# EasyEDA schematic SCH_keyboard_2024-07-08.json
TITLE: Sheet_1; REV: 1.0; Date: 2024-07-07; Sheet: 1/1; Drawn By: dtnthuy; Company: Your Company
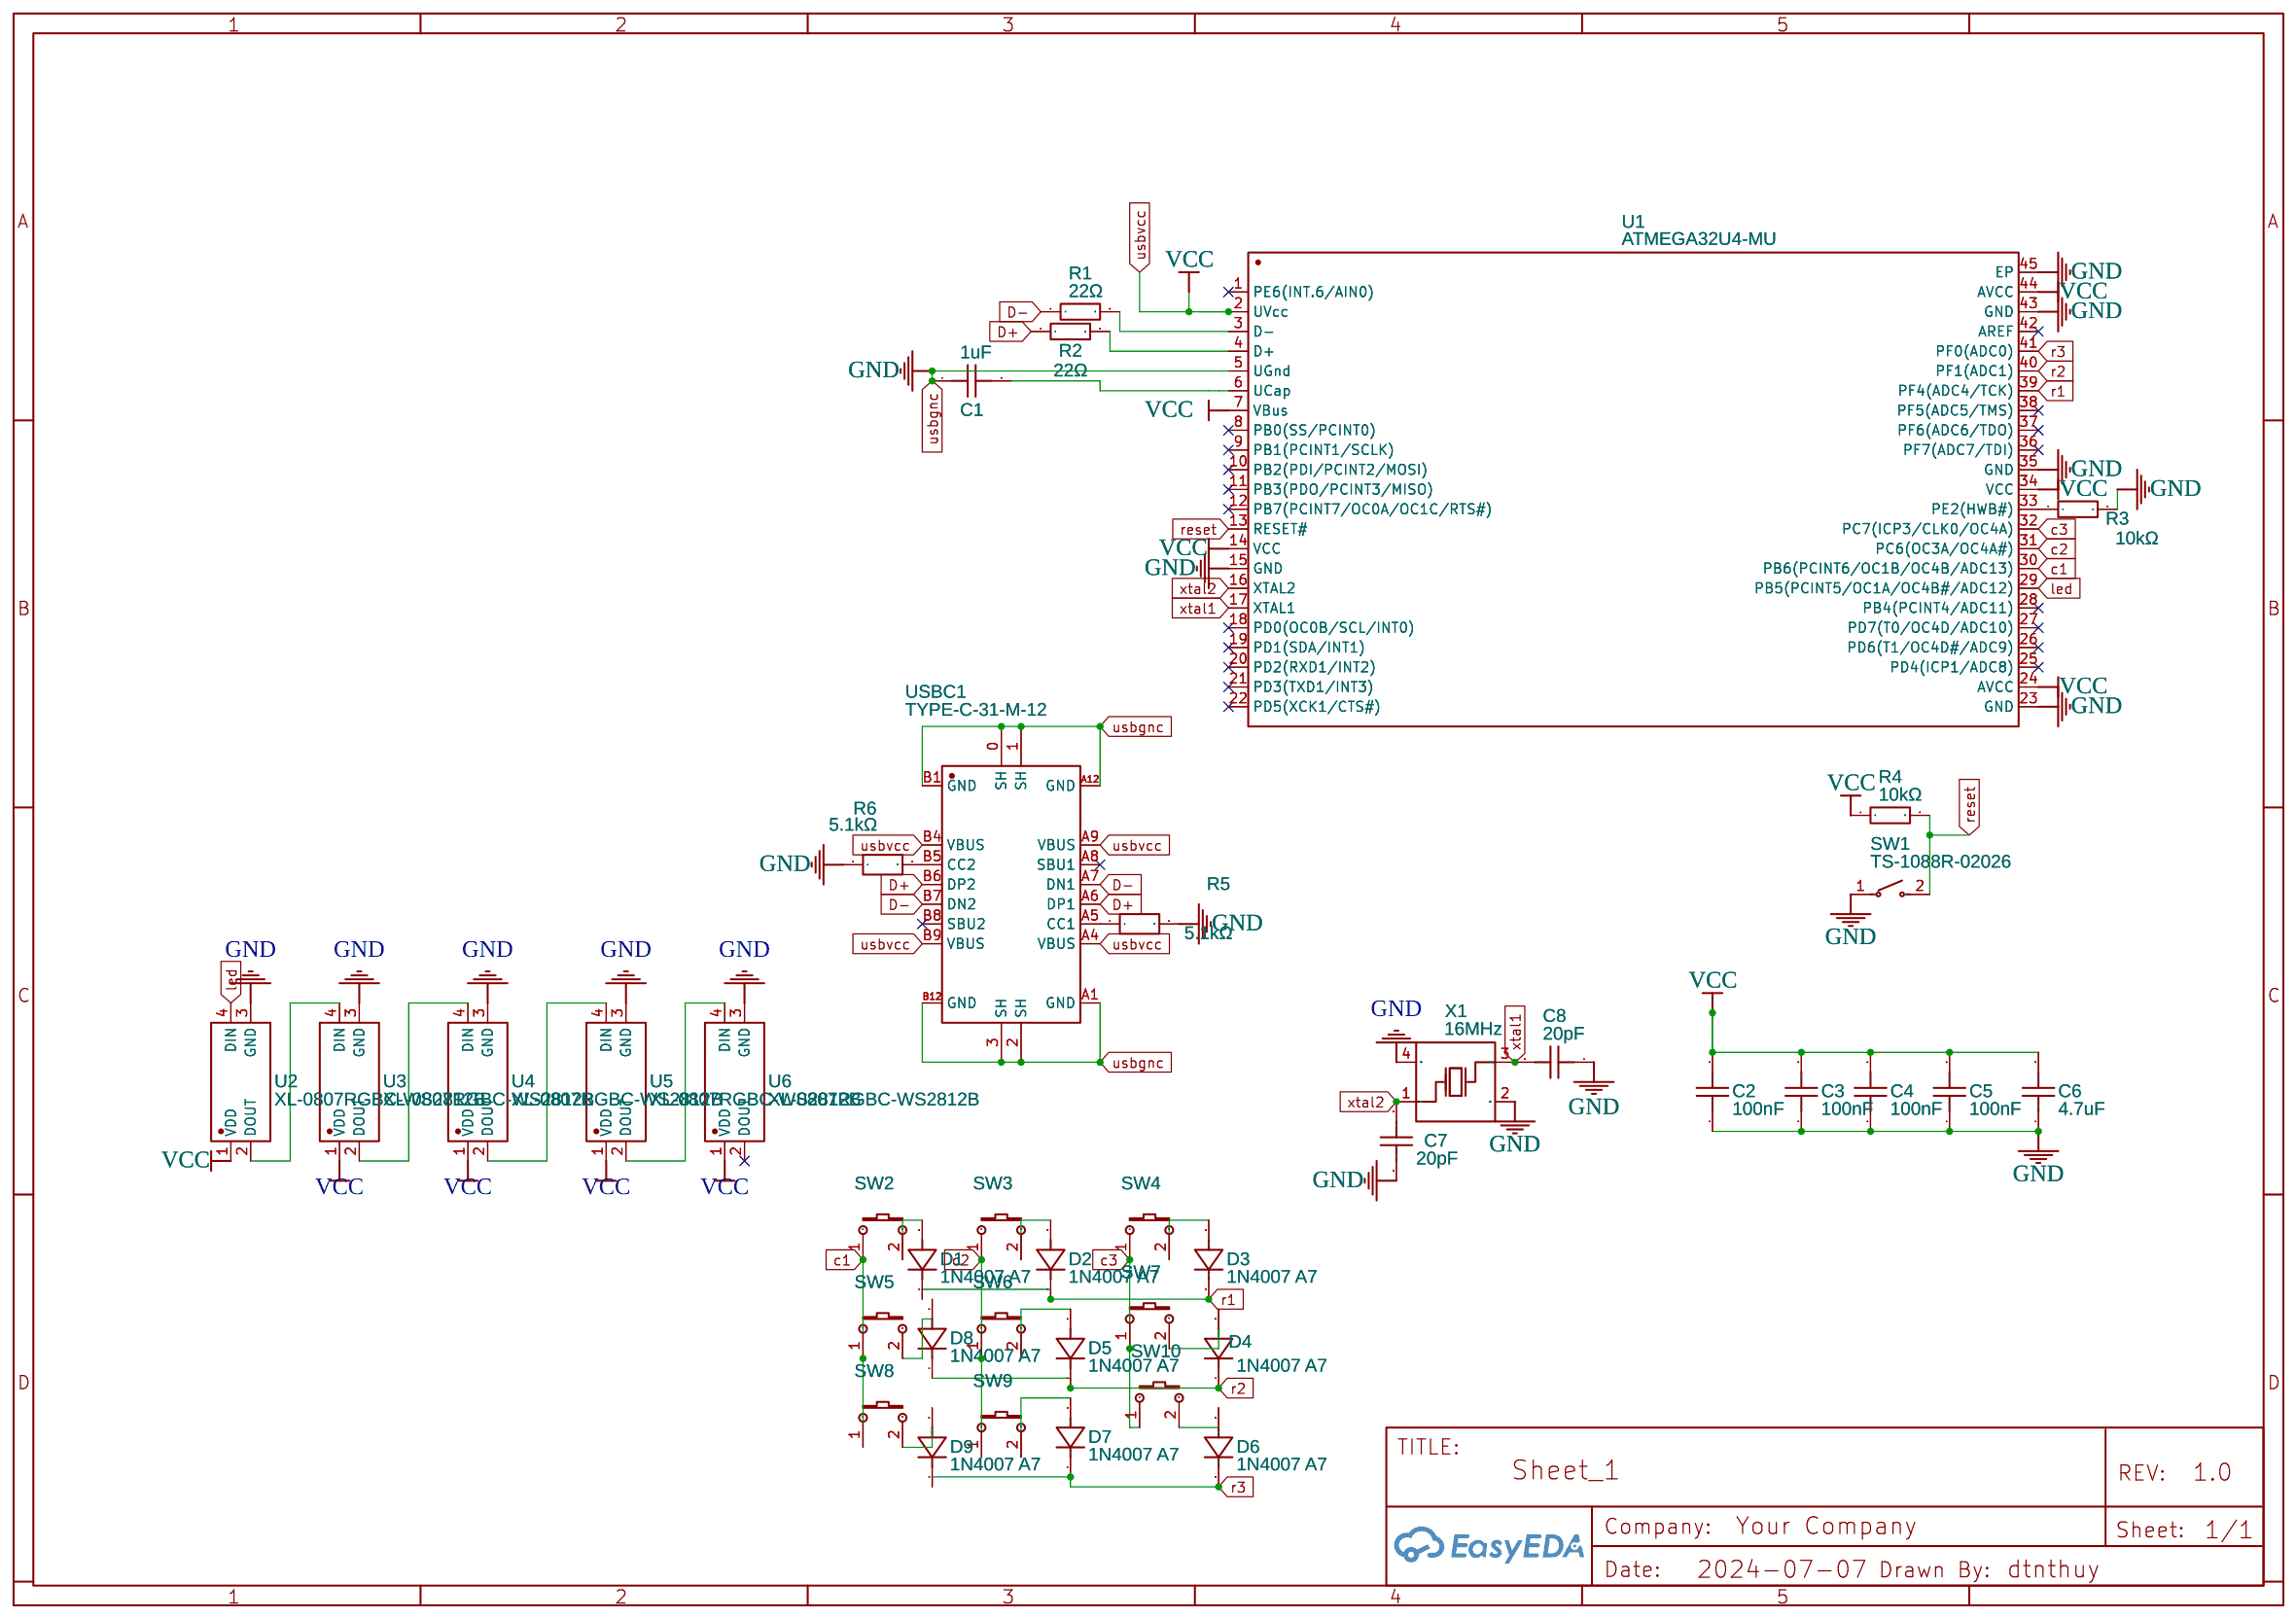
[diagram p0: schematic sheet]

## Parts
C1  1uF  [C0603]
C2  100nF  [C0402]
C3  100nF  [C0402]
C4  100nF  [C0402]
C5  100nF  [C0402]
C6  4.7uF  [C0402]
C7  20pF  [C0201]
C8  20pF  [C0201]
D1  1N4007 A7  [SOD-123FL_L2.8-W1.8-LS3.7-RD]
D2  1N4007 A7  [SOD-123FL_L2.8-W1.8-LS3.7-RD]
D3  1N4007 A7  [SOD-123FL_L2.8-W1.8-LS3.7-RD]
D4  1N4007 A7  [SOD-123FL_L2.8-W1.8-LS3.7-RD]
D5  1N4007 A7  [SOD-123FL_L2.8-W1.8-LS3.7-RD]
D6  1N4007 A7  [SOD-123FL_L2.8-W1.8-LS3.7-RD]
D7  1N4007 A7  [SOD-123FL_L2.8-W1.8-LS3.7-RD]
D8  1N4007 A7  [SOD-123FL_L2.8-W1.8-LS3.7-RD]
D9  1N4007 A7  [SOD-123FL_L2.8-W1.8-LS3.7-RD]
R1  22Ω  [R0603]
R2  22Ω  [R0603]
R3  10kΩ  [R0805]
R4  10kΩ  [R0805]
R5  5.1kΩ  [R0603]
R6  5.1kΩ  [R0603]
SW1  TS-1088R-02026  [SW-SMD_L3.9-W3.0-P4.45]
SW2  MX1A-11NW  [SW-TH_MX1A-11NW]
SW3  MX1A-11NW  [SW-TH_MX1A-11NW]
SW4  MX1A-11NW  [SW-TH_MX1A-11NW]
SW5  MX1A-11NW  [SW-TH_MX1A-11NW]
SW6  MX1A-11NW  [SW-TH_MX1A-11NW]
SW7  MX1A-11NW  [SW-TH_MX1A-11NW]
SW8  MX1A-11NW  [SW-TH_MX1A-11NW]
SW9  MX1A-11NW  [SW-TH_MX1A-11NW]
SW10  MX1A-11NW  [SW-TH_MX1A-11NW]
U1  ATMEGA32U4-MU  [VQFN-44_L7.0-W7.0-P0.50-BL-EP5.2]
U2  XL-0807RGBC-WS2812B  [LED-SMD_4P-L2.0-W1.8_CY-0807]
U3  XL-0807RGBC-WS2812B  [LED-SMD_4P-L2.0-W1.8_CY-0807]
U4  XL-0807RGBC-WS2812B  [LED-SMD_4P-L2.0-W1.8_CY-0807]
U5  XL-0807RGBC-WS2812B  [LED-SMD_4P-L2.0-W1.8_CY-0807]
U6  XL-0807RGBC-WS2812B  [LED-SMD_4P-L2.0-W1.8_CY-0807]
USBC1  TYPE-C-31-M-12  [USB-C_SMD-TYPE-C-31-M-12]
X1  16MHz  [CRYSTAL-SMD_4P-L3.2-W2.5-BL]

## Library data of the parts
C1 = CS1608X7R105K250NRB: Contributor: LCSC; Supplier: LCSC; Supplier Part: C513775; Manufacturer: SAMWHA(三和); JLCPCB Part Class: Extended Part
C2-C5 = C0402X7R104K250NT: Contributor: LCSC; Supplier: LCSC; Supplier Part: C466614; Manufacturer: SANYEAR(叁叶源); JLCPCB Part Class: Extended Part
C6 = C1005X6S0G475MTJ00E: Contributor: LCSC; Supplier: LCSC; Supplier Part: C342992; Manufacturer: TDK; JLCPCB Part Class: Extended Part
C7 C8 = 0201CG200K500NT: Contributor: LCSC; Supplier: LCSC; Supplier Part: C285071; Manufacturer: FH(风华)
D1-D9 = 1N4007 A7: Contributor: lcsc; Supplier: LCSC; Supplier Part: C2902912; Manufacturer: MSKSEMI(美森科); JLCPCB Part Class: Extended Part
R1 R2 = 0603WAJ0220T5E: Supplier: LCSC; Manufacturer: UNI-ROYAL(厚声); Supplier Part: C1203; JLCPCB Part Class: Extended Part
R3 R4 = 0805W8F1002T5E: Supplier: LCSC; Manufacturer: UNI-ROYAL(厚声); Supplier Part: C17414; JLCPCB Part Class: Basic Part
R5 R6 = RK73H1JTTD5101D: Contributor: LCSC; Supplier: LCSC; Supplier Part: C880144; Manufacturer: KOA; JLCPCB Part Class: Extended Part
SW1 = TS-1088R-02026: Contributor: LCSC; Supplier: LCSC; Supplier Part: C455280; Manufacturer: XUNPU(讯普); JLCPCB Part Class: Extended Part
SW2-SW10 = MX1A-11NW: Supplier: LCSC; Supplier Part: C3316924; Manufacturer: CHERRY; Contributor: lcsc
U1 = ATMEGA32U4-MU: Supplier: LCSC; Manufacturer: MICROCHIP(美国微芯); Supplier Part: C112161; JLCPCB Part Class: Extended Part
U2-U6 = XL-0807RGBC-WS2812B: Contributor: lcsc; Supplier: LCSC; Supplier Part: C3646929; Manufacturer: XINGLIGHT(成兴光); JLCPCB Part Class: Extended Part
USBC1 = TYPE-C-31-M-12: Contributor: LCSC; Supplier: LCSC; Supplier Part: C165948; Manufacturer: 韩国韩荣; JLCPCB Part Class: Extended Part
X1 = X322516MOB4SI: Supplier: LCSC; Manufacturer: YXC(扬兴晶振); Supplier Part: C12668; JLCPCB Part Class: Extended Part

## Nets
GND: C1.1 C2.1 C3.1 C4.1 C5.1 C6.1 C7.1 C8.1 R3.2 R5.2 R6.1 SW1.1 U1.5(UGnd) U1.15(GND) U1.23(GND) U1.35(GND) U1.43(GND) U1.45(EP) U2.3(GND) U3.3(GND) U4.3(GND) U5.3(GND) U6.3(GND) USBC1.0(SH) USBC1.1(SH) USBC1.2(SH) USBC1.3(SH) USBC1.A1(GND) USBC1.A12(GND) USBC1.B1(GND) USBC1.B12(GND) X1.2(GND) X1.4(GND)
VCC: C2.2 C3.2 C4.2 C5.2 C6.2 R4.1 U1.2(UVcc) U1.7(VBus) U1.14(VCC) U1.24(AVCC) U1.34(VCC) U1.44(AVCC) U2.1(VDD) U3.1(VDD) U4.1(VDD) U5.1(VDD) U6.1(VDD) USBC1.A4(VBUS) USBC1.A9(VBUS) USBC1.B4(VBUS) USBC1.B9(VBUS)
c1: SW2.1 SW5.1 SW8.1 U1.30(PB6(PCINT6/OC1B/OC4B/ADC13))
c2: SW3.1 SW6.1 SW9.1 U1.31(PC6(OC3A/OC4A#))
c3: SW4.1 SW7.1 SW10.1 U1.32(PC7(ICP3/CLK0/OC4A))
D+: R2.1 USBC1.A6(DP1) USBC1.B6(DP2)
D-: R1.1 USBC1.A7(DN1) USBC1.B7(DN2)
led: U1.29(PB5(PCINT5/OC1A/OC4B#/ADC12)) U2.4(DIN)
r1: D1.1(K) D2.1(K) D3.1(K) U1.39(PF4(ADC4/TCK))
r2: D4.1(K) D5.1(K) D8.1(K) U1.40(PF1(ADC1))
r3: D6.1(K) D7.1(K) D9.1(K) U1.41(PF0(ADC0))
reset: R4.2 SW1.2 U1.13(RESET#)
xtal1: C8.2 U1.17(XTAL1) X1.3(OSC2)
xtal2: C7.2 U1.16(XTAL2) X1.1(OSC1)
Net-(C1-2): C1.2 U1.6(UCap)
Net-(D1-2): D1.2(A) SW2.2
Net-(D2-2): D2.2(A) SW3.2
Net-(D3-2): D3.2(A) SW4.2
Net-(D4-2): D4.2(A) SW7.2
Net-(D5-2): D5.2(A) SW6.2
Net-(D6-2): D6.2(A) SW10.2
Net-(D7-2): D7.2(A) SW9.2
Net-(D8-2): D8.2(A) SW5.2
Net-(D9-2): D9.2(A) SW8.2
Net-(R1-2): R1.2 U1.3(D-)
Net-(R2-2): R2.2 U1.4(D+)
Net-(R3-1): R3.1 U1.33(PE2(HWB#))
Net-(R5-1): R5.1 USBC1.A5(CC1)
Net-(R6-2): R6.2 USBC1.B5(CC2)
Net-(U2-2): U2.2(DOUT) U3.4(DIN)
Net-(U3-2): U3.2(DOUT) U4.4(DIN)
Net-(U4-2): U4.2(DOUT) U5.4(DIN)
Net-(U5-2): U5.2(DOUT) U6.4(DIN)

Not connected (* = marked no-connect by the designer): U1 1(PE6(INT.6/AIN0))* 8(PB0(SS/PCINT0))* 9(PB1(PCINT1/SCLK))* 10(PB2(PDI/PCINT2/MOSI))* 11(PB3(PDO/PCINT3/MISO))* 12(PB7(PCINT7/OC0A/OC1C/RTS#))* 18(PD0(OC0B/SCL/INT0))* 19(PD1(SDA/INT1))* 20(PD2(RXD1/INT2))* 21(PD3(TXD1/INT3))* 22(PD5(XCK1/CTS#))* 25(PD4(ICP1/ADC8))* 26(PD6(T1/OC4D#/ADC9))* 27(PD7(T0/OC4D/ADC10))* 28(PB4(PCINT4/ADC11))* 36(PF7(ADC7/TDI))* 37(PF6(ADC6/TDO))* 38(PF5(ADC5/TMS))* 42(AREF)*; U6 2(DOUT)*; USBC1 A8(SBU1)* B8(SBU2)*
